# Altium project Main_Board.PrjPcb
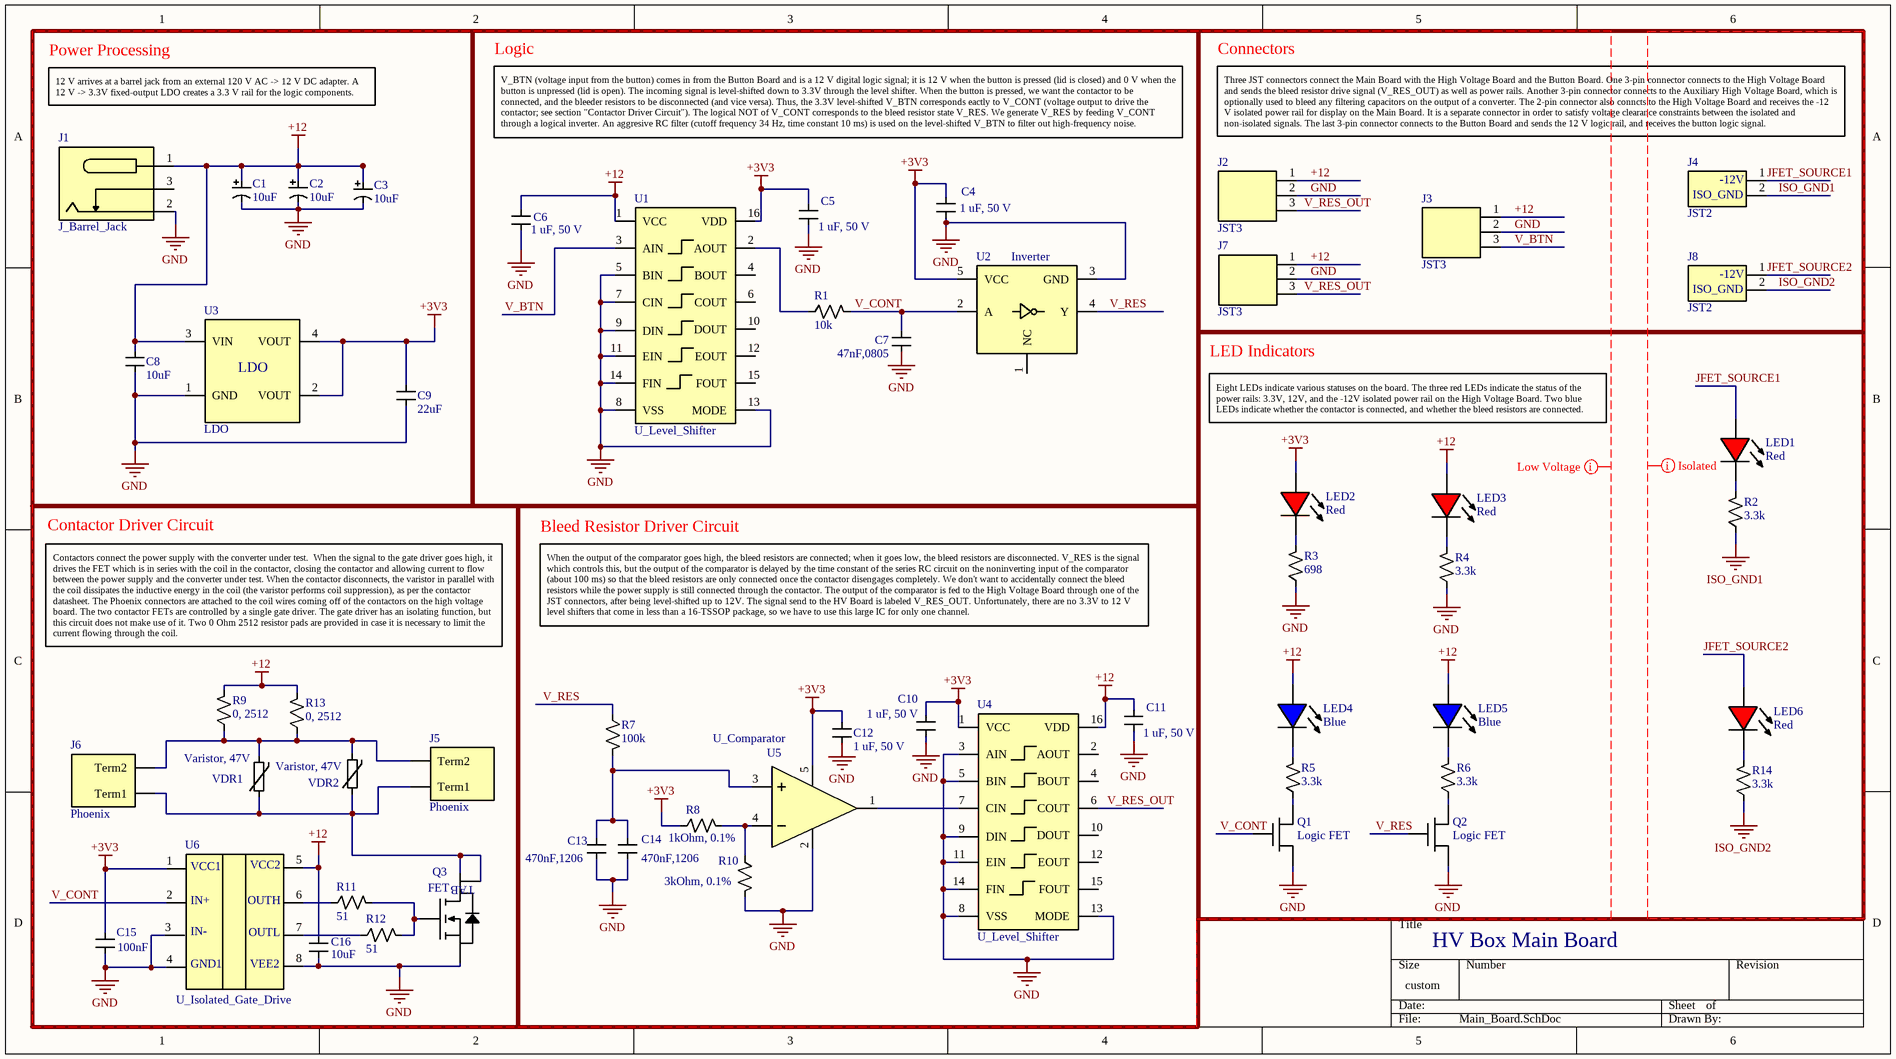
[diagram p0: Main_Board.SchDoc]
1 sheet, 55 parts. Net scope: global (net labels, ports and power ports of the same name join across sheets).
Board file: Main_Board_PCB.PcbDoc

## Sheet Main_Board.SchDoc
size 354 x 197 mm; SheetNumber: 1; SheetTotal: 1

### Parts
C1  10uF  [ALUM_CAP]
C2  10uF  [ALUM_CAP]
C3  10uF  [ALUM_CAP]
C4  1 uF, 50 V  [0603_CAP]
C5  1 uF, 50 V  [0603_CAP]
C6  1 uF, 50 V  [0603_CAP]
C7  47nF,0805  [0805_CAP]
C8  10uF  [0805_CAP]
C9  22uF  [1206_CAP]
C10  1 uF, 50 V  [0603_CAP]
C11  1 uF, 50 V  [0603_CAP]
C12  1 uF, 50 V  [0603_CAP]
C13  470nF,1206  [1206_CAP]
C14  470nF,1206  [1206_CAP]
C15  100nF  [0603_CAP]
C16  10uF  [0805_CAP]
J1  J_Barrel_Jack  [PWR_JACK]
J2  JST3  [JST_3]
J3  JST3  [JST_3]
J4  JST2  [JST_2]
J5  Phoenix  [PHOENIX_CONNECTOR_SMALL]
J6  Phoenix  [PHOENIX_CONNECTOR_SMALL]
J7  JST3  [JST_3]
J8  JST2  [JST_2]
LED1  Red  [0603_LED]
LED2  Red  [0603_LED]
LED3  Red  [0603_LED]
LED4  Blue  [0603_LED]
LED5  Blue  [0603_LED]
LED6  Red  [0603_LED]
Q1  Logic FET  [SOT23]
Q2  Logic FET  [SOT23]
Q3  FET  [TO-220]
R1  10k  [0603_RES]
R2  3.3k  [0603_RES]
R3  698  [0603_RES]
R4  3.3k  [0603_RES]
R5  3.3k  [0603_RES]
R6  3.3k  [0603_RES]
R7  100k  [0603_RES]
R8  1kOhm, 0.1%  [0603_RES]
R9  0, 2512  [2512_RES]
R10  3kOhm, 0.1%  [0603_RES]
R11  51  [0603_RES]
R12  51  [0603_RES]
R13  0, 2512  [2512_RES]
R14  3.3k  [0603_RES]
U1  U_Level_Shifter  [TSSOP-16]
U2  Inverter  [SOT23-5]
U3  LDO  [SOT223-3]
U4  U_Level_Shifter  [TSSOP-16]
U5  U_Comparator  [SC70]
U6  U_Isolated_Gate_Drive  [GATE_DRIVER]
VDR1  Varistor, 47V  [VARISTOR]
VDR2  Varistor, 47V  [VARISTOR]

### Blocks framed on the sheet
Power Processing: C1-C3 C8 C9 J1 U3
Logic: C4-C7 R1 U1 U2
Connectors: J2-J4 J7 J8
LED Indicators: LED1-LED6 Q1 Q2 R2-R6 R14
Contactor Driver Circuit: C15 C16 J5 J6 Q3 R9 R11-R13 U6 VDR1 VDR2
Bleed Resistor Driver Circuit: C10-C14 R7 R8 R10 U4 U5

### Nets
+3V3: C4.2 C5.2 C9.2 C10.2 C12.2 C15.2 LED2.2 R8.1 U1.16(VDD) U2.5(VCC) U3.2(VOUT) U3.4(VOUT) U4.1(VCC) U5.5(VDD) U6.1(VCC1)
+12: C1.2 C2.2 C3.2 C6.2 C8.2 C11.2 C16.2 J1.1(GND) J2.1(Sig1) J3.1(Sig1) J7.1(Sig1) LED3.2 LED4.2 LED5.2 R9.2 R13.2 U1.1(VCC) U3.3(VIN) U4.16(VDD) U6.5(VCC2)
GND: C1.1 C2.1 C3.1 C4.1 C5.1 C6.1 C7.1 C8.1 C9.1 C10.1 C11.1 C12.1 C13.1 C14.1 C15.1 C16.1 J1.2(PWR_JACK) J2.2(Sig2) J3.2(Sig2) J7.2(Sig2) Q1.3(S) Q2.3(S) Q3.3(S) R3.1 R4.1 R10.2 U1.5(BIN) U1.7(CIN) U1.8(VSS) U1.9(DIN) U1.11(EIN) U1.13(MODE) U1.14(FIN) U2.3(GND) U3.1(GND) U4.3(AIN) U4.5(BIN) U4.8(VSS) U4.9(DIN) U4.11(EIN) U4.13(MODE) U4.14(FIN) U5.2(GND) U6.3(IN-) U6.4(GND1) U6.8(VEE2)
ISO_GND1: J4.2(Sig2) R2.1
ISO_GND2: J8.2(Sig2) R14.1
JFET_SOURCE1: J4.1(Sig1) LED1.2
JFET_SOURCE2: J8.1(Sig1) LED6.2
V_BTN: J3.3(NC) U1.3(AIN)
V_CONT: C7.2 Q1.2(G) R1.2 U2.2(A) U6.2(IN+)
V_RES: Q2.2(G) R7.1 U2.4(Y)
V_RES_OUT: J2.3(NC) J7.3(NC) U4.6(COUT)
NetC13_2: C13.2 C14.2 R7.2 U5.3(V+)
NetJ5_1: J5.1(Term1) J6.1(Term1) Q3.2(D) Q3.4(TAB) VDR1.1 VDR2.1
NetJ5_2: J5.2(Term2) J6.2(Term2) R9.1 R13.1 VDR1.2 VDR2.2
NetLED1_1: LED1.1 R2.2
NetLED2_1: LED2.1 R3.2
NetLED3_1: LED3.1 R4.2
NetLED4_1: LED4.1 R5.2
NetLED5_1: LED5.1 R6.2
NetLED6_1: LED6.1 R14.2
NetQ1_1: Q1.1(D) R5.1
NetQ2_1: Q2.1(D) R6.1
NetQ3_1: Q3.1(G) R11.2 R12.2
NetR1_1: R1.1 U1.2(AOUT)
NetR8_2: R8.2 R10.1 U5.4(V-)
NetR11_1: R11.1 U6.6(OUTH)
NetR12_1: R12.1 U6.7(OUTL)
NetU4_7: U4.7(CIN) U5.1(Out)

Not connected (* = marked no-connect by the designer): J1 3(PWR_BAT); U1 4(BOUT) 6(COUT) 10(DOUT) 12(EOUT) 15(FOUT); U2 1(NC); U4 2(AOUT) 4(BOUT) 10(DOUT) 12(EOUT) 15(FOUT)

### Layout directives
net class Low Voltage: +3V3, +12, GND, V_BTN, V_CONT, V_RES, V_RES_OUT
net class Isolated: ISO_GND1, ISO_GND2, JFET_SOURCE1, JFET_SOURCE2

### Notes on the sheet
- 12 V arrives at a barrel jack from an external 120 V AC -> 12 V DC adapter. A 12 V -> 3.3V fixed-output LDO creates a 3.3 V rail for the logic components.
- V_BTN (voltage input from the button) comes in from the Button Board and is a 12 V digital logic signal; it is 12 V when the button is pressed (lid is closed) and 0 V when the button is unpressed (lid is open). The incoming signal is level-shifted down to 3.3V through the level shifter. When the button is pressed, we want the contactor to be connected, and the bleeder resistors to be disconnected (and vice versa). Thus, the 3.3V level-shifted V_BTN corresponds eactly to V_CONT (voltage output to drive the contactor; see section "Contactor Driver Circuit"). The logical NOT of V_CONT corresponds to the bleed resistor state V_RES. We generate V_RES by feeding V_CONT through a logical inverter. An aggresive RC filter (cutoff frequency 34 Hz, time constant 10 ms) is used on the level-shifted V_BTN to filter out high-frequency noise.
- Three JST connectors connect the Main Board with the High Voltage Board and the Button Board. One 3-pin connector connects to the High Voltage Board and sends the bleed resistor drive signal (V_RES_OUT) as well as power rails. Another 3-pin connector connects to the Auxiliary High Voltage Board, which is optionally used to bleed any filtering capacitors on the output of a converter. The 2-pin connector also conncts to the High Voltage Board and receives the -12 V isolated power rail for display on the Main Board. It is a separate connector in order to satisfy voltage clearance constraints between the isolated and non-isolated signals. The last 3-pin connector connects to the Button Board and sends the 12 V logic rail, and receives the button logic signal.
- Eight LEDs indicate various statuses on the board. The three red LEDs indicate the status of the power rails: 3.3V, 12V, and the -12V isolated power rail on the High Voltage Board. Two blue LEDs indicate whether the contactor is connected, and whether the bleed resistors are connected.
- Contactors connect the power supply with the converter under test.  When the signal to the gate driver goes high, it drives the FET which is in series with the coil in the contactor, closing the contactor and allowing current to flow between the power supply and the converter under test. When the contactor disconnects, the varistor in parallel with the coil dissipates the inductive energy in the coil (the varistor performs coil suppression), as per the contactor datasheet. The Phoenix connectors are attached to the coil wires coming off of the contactors on the high voltage board. The two contactor FETs are controlled by a single gate driver. The gate driver has an isolating function, but this circuit does not make use of it. Two 0 Ohm 2512 resistor pads are provided in case it is necessary to limit the current flowing through the coil.
- When the output of the comparator goes high, the bleed resistors are connected; when it goes low, the bleed resistors are disconnected. V_RES is the signal which controls this, but the output of the comparator is delayed by the time constant of the series RC circuit on the noninverting input of the comparator (about 100 ms) so that the bleed resistors are only connected once the contactor disengages completely. We don't want to accidentally connect the bleed resistors while the power supply is still connected through the contactor. The output of the comparator is fed to the High Voltage Board through one of the JST connectors, after being level-shifted up to 12V. The signal send to the HV Board is labeled V_RES_OUT. Unfortunately, there are no 3.3V to 12 V level shifters that come in less than a 16-TSSOP package, so we have to use this large IC for only one channel.
- HV Box Main Board
- (in symbol J_JST_2) -12V; ISO_GND

### Library data of the parts
C1-C3 = C_10uF_AlElec: Capacitor SMD Aluminum Electrolytic 10 uF
C4-C6 C10-C12 = C_1uF_0603: Capacitor SMD MLCC 1 uF, 0603, 50 V
C7 = C_47nF_0805: Capacitor SMD MLCC 47 nF 0805, C0G/NP0
C8 C16 = C_10uF_0805: Capacitor SMD MLCC 10 uF 0805
C9 = C_22uF_1206: Capacitor SMD MLCC 22 uF 25 V 1206
C13 C14 = C_470nF_1206: Capacitor SMD MLCC 470 nF 1206, C0G/NP0
C15 = C_100nF_0603: Capacitor SMD MLCC 100 nF 0603
J1 = J_Barrel_Jack: Jack 12 V Barrel Jack Power Plug
J2 J3 J7 = J_JST_3: Jack JST 3-pin
J4 J8 = J_JST_2: Jack JST 2-pin; System: Connector
J5 J6 = J_Phoenix_Small: Phoenix Connector, Female, 2 position, 2 A, 250 V per position
LED1-LED3 LED6 = LED_0603_Red: LED SMD 0603 Red
LED4 LED5 = LED_0603_Blue: LED SMD 0603 Blue
Q1 Q2 = Q_NFET: N-Channel Logic FET SOT23-3
Q3 = Q_NFET_150V: N-Channel Power FET 150 V 100 A
R1 = R_10kOhm_0603_1%: Resistor 10 kOhm 0603 1%
R2 R4-R6 R14 = R_3300Ohm_0603_1%: Resistor 3.3 kOhm 0603 1%
R3 = R_698Ohm_0603_0.5%: Resistor 698 Ohm 0603 0.5%
R7 = R_100kOhm_0603_0.5%: Resistor 100 kOhm 0603 0.5%
R8 = R_1kOhm_0603_0.1%: Resistor 1 kOhm 0603 0.1%
R9 R13 = R_0Ohm_2512: Resistor 0 Ohm 2512
R10 = R_3kOhm_0603_0.1%_1: Resistor 3 kOhm 0603 0.1%
R11 R12 = R_51Ohm_0603_1%: Resistor 51 Ohm 0603 1%
U1 U4 = U_Level_Shifter: IC 6-in-1 level shifter
U2 = U_Inverter_1: IC Single Inverter
U3 = U_LDO_12V_3V3: IC LDO Fixed Output 3.3V, input up to 12 V, SOT223-3 Package
U5 = U_Comparator: IC 3.3V Comparator Push-Pull
U6 = U_Isolated_Gate_Drive: IC Isolated Gate Drive 3-15 V Output Supply Split Output
VDR1 VDR2 = VDR_47V: Varistor, 47 V, 500 A, 10 mm Disc Through-Hole